# Altium schematic sheet Sheet_1.schdoc
size 146 x 89 mm
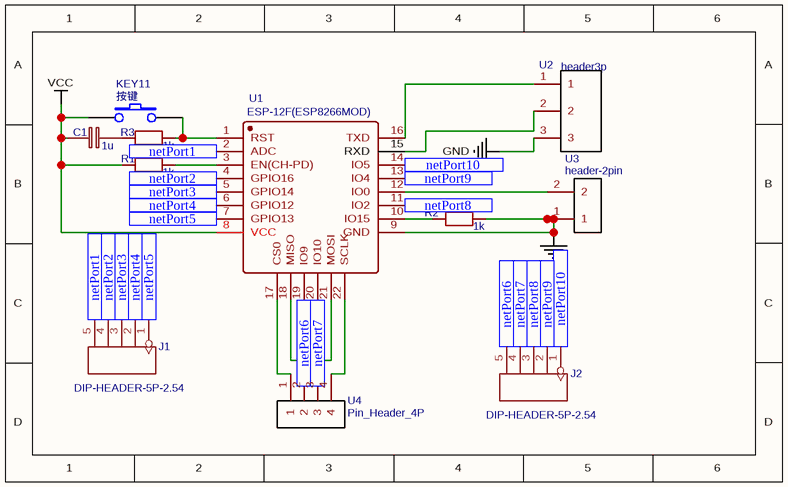
[diagram p0: Sheet_1.schdoc]

## Parts
C1  1u  [C0603]
J1  DIP-HEADER-5P-2.54  [H5-2.54]
J2  DIP-HEADER-5P-2.54  [H5-2.54]
KEY11  按键  [按键]
R1  1k  [R0603]
R2  1k  [R0603]
R3  1k  [R0603]
U1  ESP-12F(ESP8266MOD)  [WIFIM-SMD_ESP-12F-ESP8266MOD]
U2  header3p  [HEADER-3PIN]
U3  header-2pin  [HEADER_2_PIN]
U4  Pin_Header_4P  [PIN_HEADER_4P]

## Ports
netPort1 (in), netPort2 (in), netPort3 (in), netPort4 (in), netPort5 (in), netPort6 (in), netPort7 (in), netPort8 (in), netPort9 (in), netPort10 (in)

## Nets
GND: R2.2 U1.9(GND) U2.3 U3.1
VCC: C1.1 KEY11.1 R1.1 U1.8(VCC)
netPort1: J1.5 U1.2(ADC) ; port netPort1
netPort2: J1.4 U1.4(GPIO16) ; port netPort2
netPort3: J1.3 U1.5(GPIO14) ; port netPort3
netPort4: J1.2 U1.6(GPIO12) ; port netPort4
netPort5: J1.1 U1.7(GPIO13) ; port netPort5
netPort6: J2.5 U1.19(IO9) ; port netPort6
netPort7: J2.4 U1.20(IO10) ; port netPort7
netPort8: J2.3 U1.11(IO2) ; port netPort8
netPort9: J2.2 U1.13(IO4) ; port netPort9
netPort10: J2.1 U1.14(IO5) ; port netPort10
NetC1_2: C1.2 R3.1
NetKEY11_2: KEY11.2 R3.2 U1.1(RST)
NetR1_2: R1.2 U1.3(EN(CH-PD))
NetR2_1: R2.1 U1.10(IO15)
NetU1_12: U1.12(IO0) U3.2
NetU1_15: U1.15(RXD) U2.2
NetU1_16: U1.16(TXD) U2.1
NetU1_17: U1.17(CS0) U4.1
NetU1_18: U1.18(MISO) U4.2
NetU1_21: U1.21(MOSI) U4.3
NetU1_22: U1.22(SCLK) U4.4

## Library data of the parts
C1 = 1u: nameAlias: Value(F); spicePre: C; spiceSymbolName: Cap_RAD-0.1_EU
J1 J2 = DIP-HEADER-5P-2.54: BOM_Manufacturer Part: P125-1105A0BASYA1; description: DIP Black Male Header;; sourceId: MEysmEWd7; BOM_Supplier Part: 320020111; BOM_Supplier: SeeedStudio; timeStamp: 1475462087; spicePre: J; spiceSymbolName: DIP-HEADER-5P-2.54
KEY11 = 按键: Contributor: jor13854962020; spicePre: K; spiceSymbolName: 按键
R1-R3 = 1k: nameAlias: Value(Ω); spicePre: R; spiceSymbolName: Res_AXIAL-0.3(1/8W)_EU
U1 = ESP-12F(ESP8266MOD): BOM_Manufacturer: Ai-Thinker; BOM_Supplier: LCSC; BOM_Manufacturer Part: ESP-12F(ESP8266MOD); BOM_Supplier Part: C82891; spicePre: U; spiceSymbolName: ESP-12F(ESP8266MOD)
U2 = header3p: BOM_Manufacturer Part: 3p接线端子; Contributor: dhx233; spicePre: U; spiceSymbolName: header3p
U3 = header-2pin: Contributor: maomaomaoa; Package Display: No; spicePre: U; spiceSymbolName: header-2pin
U4 = Pin_Header_4P: Contributor: tbertoss; BOM_Manufacturer Part: Pin_Header_4P; spicePre: U; spiceSymbolName: Pin_Header_4P